# Altium schematic sheet 06-USB3_PCIe.SchDoc: USB3.0 Interface & EEPROM, PCIe
size A3; DrawnBy: Rain Adelbert; Revision: 1.2; SheetNumber: 6; SheetTotal: 9
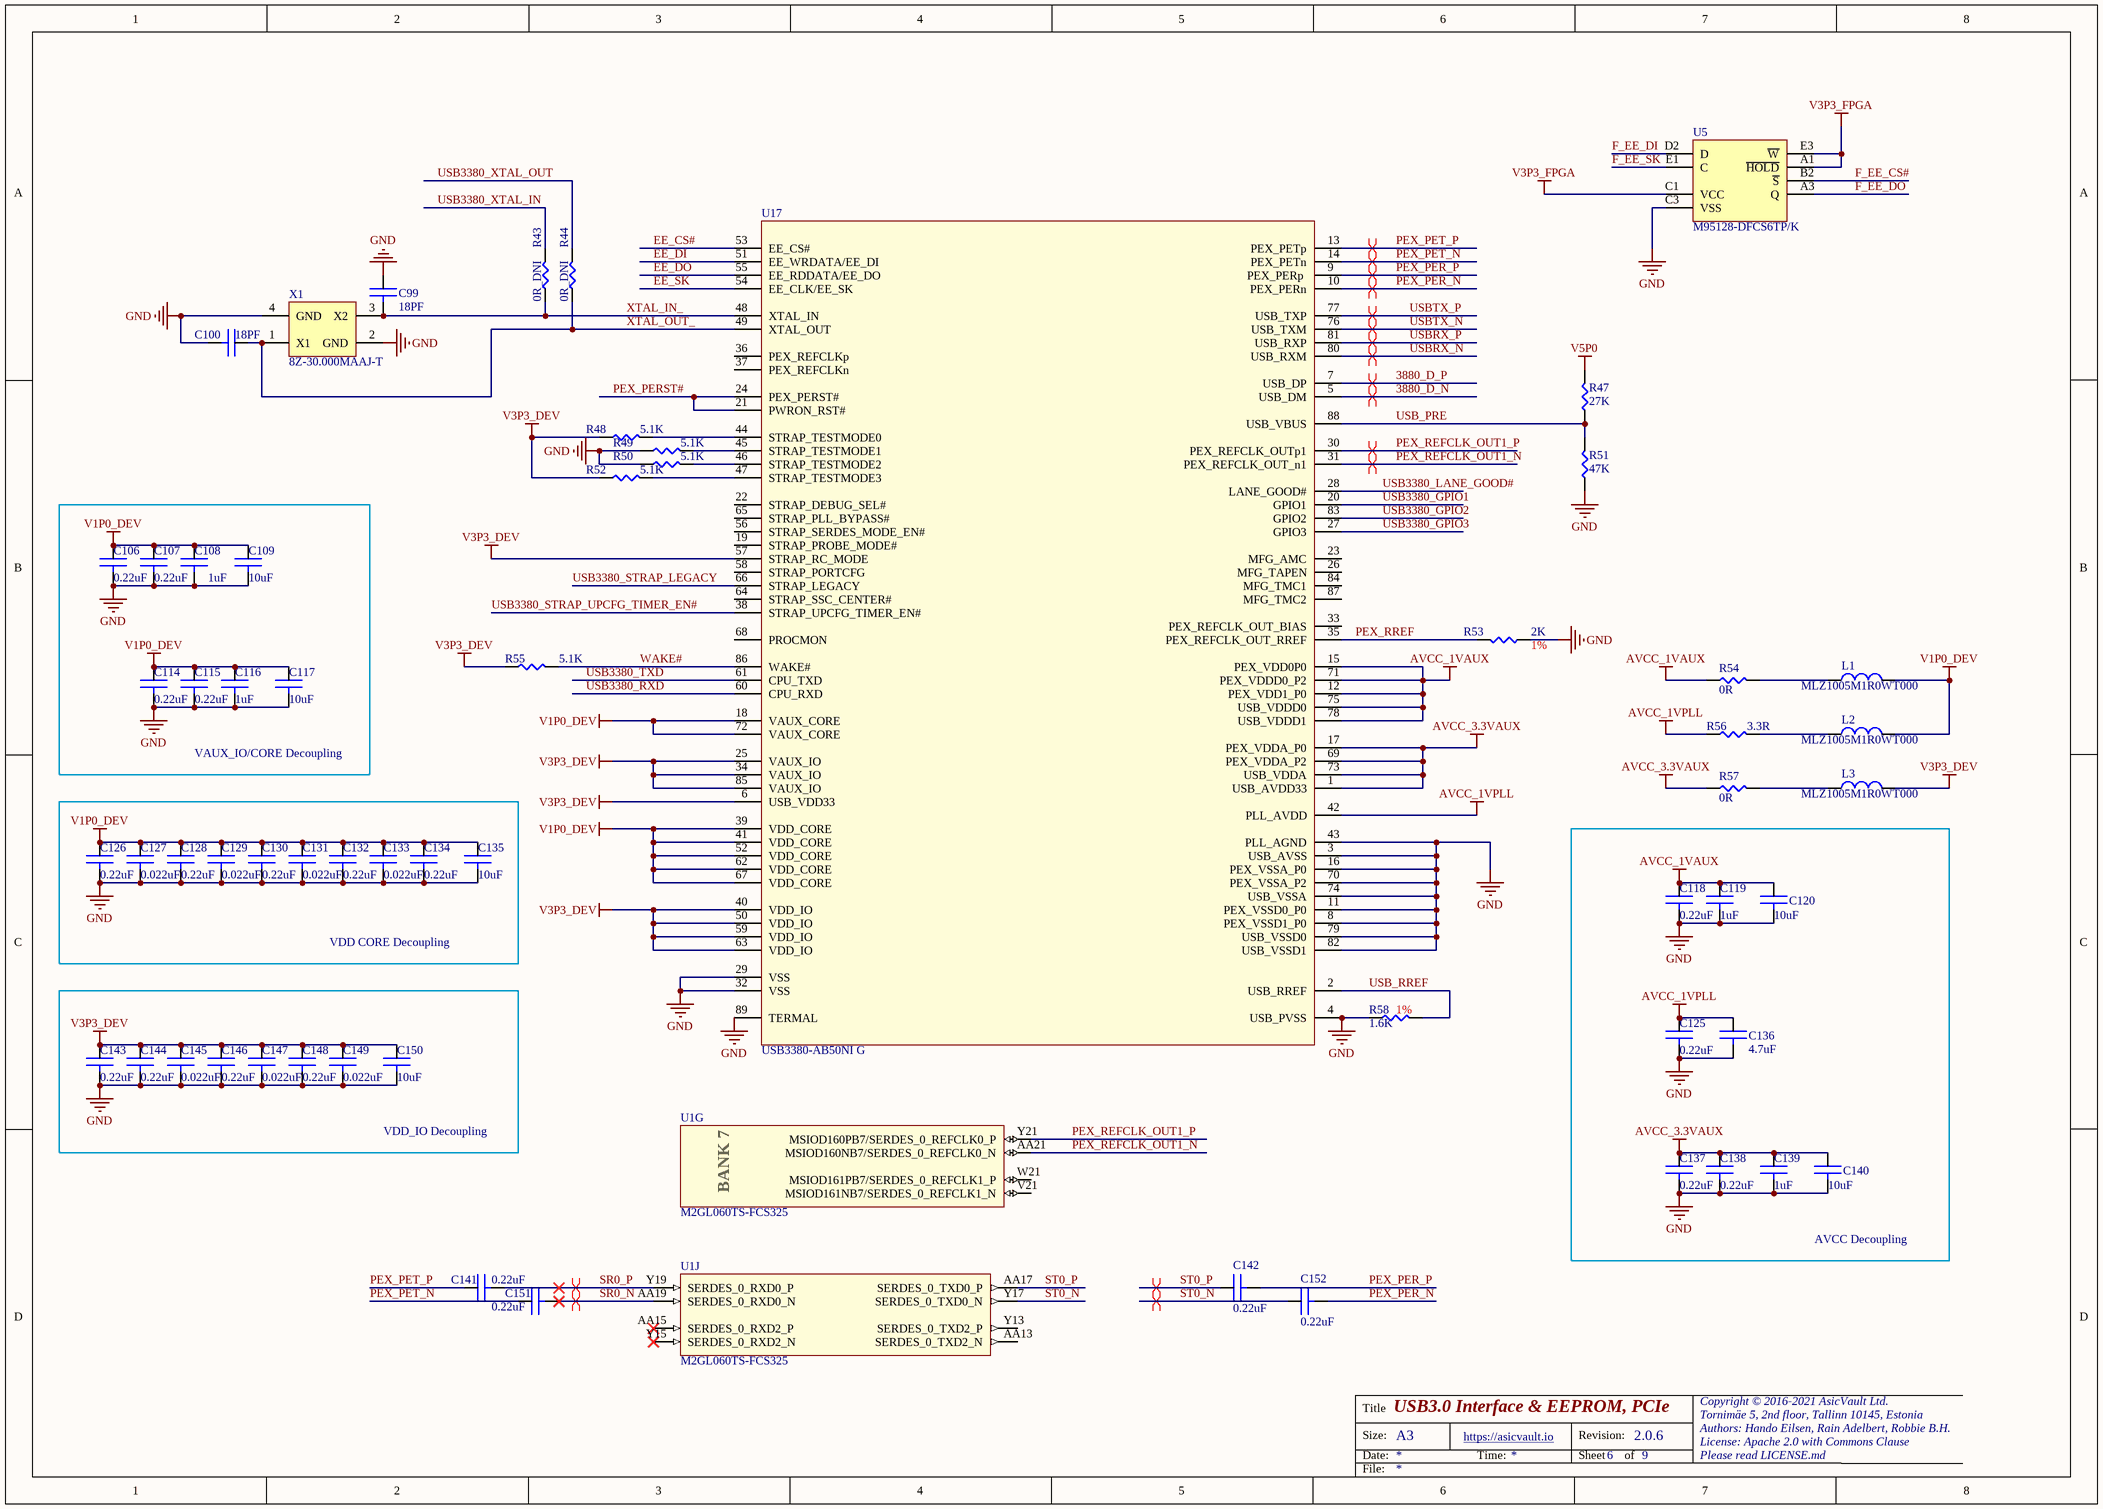
[diagram p0: 06-USB3_PCIe.SchDoc]

## Parts
C99  18PF  [C0201]
C100  18PF  [C0201]
C106  0.22uF  [C0201]
C107  0.22uF  [C0201]
C108  1uF  [C0201]
C109  10uF  [C0402]
C114  0.22uF  [C0201]
C115  0.22uF  [C0201]
C116  1uF  [C0201]
C117  10uF  [C0402]
C118  0.22uF  [C0201]
C119  1uF  [C0201]
C120  10uF  [C0402]
C125  0.22uF  [C0201]
C126  0.22uF  [C0201]
C127  0.022uF  [C0201]
C128  0.22uF  [C0201]
C129  0.022uF  [C0201]
C130  0.22uF  [C0201]
C131  0.022uF  [C0201]
C132  0.22uF  [C0201]
C133  0.022uF  [C0201]
C134  0.22uF  [C0201]
C135  10uF  [C0402]
C136  4.7uF  [C0201]
C137  0.22uF  [C0201]
C138  0.22uF  [C0201]
C139  1uF  [C0201]
C140  10uF  [C0402]
C141  0.22uF  [C0201]
C142  0.22uF  [C0201]
C143  0.22uF  [C0201]
C144  0.22uF  [C0201]
C145  0.022uF  [C0201]
C146  0.22uF  [C0201]
C147  0.022uF  [C0201]
C148  0.22uF  [C0201]
C149  0.022uF  [C0201]
C150  10uF  [C0402]
C151  0.22uF  [C0201]
C152  0.22uF  [C0201]
L1  MLZ1005M1R0WT000  [L0402]
L2  MLZ1005M1R0WT000  [L0402]
L3  MLZ1005M1R0WT000  [L0402]
R43  0R_DNI  [R0201]
R44  0R_DNI  [R0201]
R47  27K  [R0201]
R48  5.1K  [R0201]
R49  5.1K  [R0201]
R50  5.1K  [R0201]
R51  47K  [R0201]
R52  5.1K  [R0201]
R53  2K  [R0201]
R54  0R  [R0201]
R55  5.1K  [R0201]
R56  3.3R  [R0201]
R57  0R  [R0201]
R58  1.6K  [R0201]
U1  M2GL060TS-FCS325  [FCS325-OPT1]  (parts G,J of 16)
U5  M95128-DFCS6TP/K  [WLCSP8]
U17  USB3380-AB50NI G  [QFN88P]
X1  8Z-30.000MAAJ-T  [2520]

## Blocks framed on the sheet
VAUX_IO/CORE Decoupling: C106-C109 C114-C117
VDD CORE Decoupling: C126-C135
AVCC Decoupling: C118-C120 C125 C136-C140
VDD_IO Decoupling: C143-C150

## Nets
AVCC_1VAUX: C118.1 C119.1 C120.1 R54.1 U17.12(PEX_VDD1_P0) U17.15(PEX_VDD0P0) U17.71(PEX_VDDD0_P2) U17.75(USB_VDDD0) U17.78(USB_VDDD1)
AVCC_1VPLL: C125.1 C136.1 R56.1 U17.42(PLL_AVDD)
AVCC_3.3VAUX: C137.1 C138.1 C139.1 C140.1 R57.1 U17.1(USB_AVDD33) U17.17(PEX_VDDA_P0) U17.69(PEX_VDDA_P2) U17.73(USB_VDDA)
GND: C99.1 C100.2 C106.2 C107.2 C108.2 C109.2 C114.2 C115.2 C116.2 C117.2 C118.2 C119.2 C120.2 C125.2 C126.2 C127.2 C128.2 C129.2 C130.2 C131.2 C132.2 C133.2 C134.2 C135.2 C136.2 C137.2 C138.2 C139.2 C140.2 C143.2 C144.2 C145.2 C146.2 C147.2 C148.2 C149.2 C150.2 R49.1 R50.1 R51.1 R53.1 R58.1 U5.C3(VSS) U17.3(USB_AVSS) U17.4(USB_PVSS) U17.8(PEX_VSSD1_P0) U17.11(PEX_VSSD0_P0) U17.16(PEX_VSSA_P0) U17.29(VSS) U17.32(VSS) U17.43(PLL_AGND) U17.70(PEX_VSSA_P2) U17.74(USB_VSSA) U17.79(USB_VSSD0) U17.82(USB_VSSD1) U17.89(TERMAL) X1.2(GND) X1.4(GND)
V1P0_DEV: C106.1 C107.1 C108.1 C109.1 C114.1 C115.1 C116.1 C117.1 C126.1 C127.1 C128.1 C129.1 C130.1 C131.1 C132.1 C133.1 C134.1 C135.1 L1.2 L2.2 U17.18(VAUX_CORE) U17.39(VDD_CORE) U17.41(VDD_CORE) U17.52(VDD_CORE) U17.62(VDD_CORE) U17.67(VDD_CORE) U17.72(VAUX_CORE)
V3P3_DEV: C143.1 C144.1 C145.1 C146.1 C147.1 C148.1 C149.1 C150.1 L3.2 R48.1 R52.1 R55.1 U17.6(USB_VDD33) U17.25(VAUX_IO) U17.34(VAUX_IO) U17.40(VDD_IO) U17.50(VDD_IO) U17.57(STRAP_RC_MODE) U17.59(VDD_IO) U17.63(VDD_IO) U17.85(VAUX_IO)
V3P3_FPGA: U5.A1(~{HOLD}) U5.C1(VCC) U5.E3(~{W})
V5P0: R47.2
3880_D_N: U17.5(USB_DM)
3880_D_P: U17.7(USB_DP)
EE_CS#: U17.53(EE_CS#)
EE_DI: U17.51(EE_WRDATA/EE_DI)
EE_DO: U17.55(EE_RDDATA/EE_DO)
EE_SK: U17.54(EE_CLK/EE_SK)
F_EE_CS#: U5.B2(~{S})
F_EE_DI: U5.D2(D)
F_EE_DO: U5.A3(Q)
F_EE_SK: U5.E1(C)
PEX_PER_N: C152.2 U17.10(PEX_PERn)
PEX_PER_P: C142.2 U17.9(PEX_PERp)
PEX_PERST#: U17.21(PWRON_RST#) U17.24(PEX_PERST#)
PEX_PET_N: C151.1 U17.14(PEX_PETn)
PEX_PET_P: C141.1 U17.13(PEX_PETp)
PEX_REFCLK_OUT1_N: U1.AA21(MSIOD160NB7/SERDES_0_REFCLK0_N) U17.31(PEX_REFCLK_OUT_n1)
PEX_REFCLK_OUT1_P: U1.Y21(MSIOD160PB7/SERDES_0_REFCLK0_P) U17.30(PEX_REFCLK_OUTp1)
PEX_RREF: R53.2 U17.35(PEX_REFCLK_OUT_RREF)
SR0_N: C151.2 U1.AA19(SERDES_0_RXD0_N)
SR0_P: C141.2 U1.Y19(SERDES_0_RXD0_P)
ST0_N: C152.1 U1.Y17(SERDES_0_TXD0_N)
ST0_P: C142.1 U1.AA17(SERDES_0_TXD0_P)
USB3380_GPIO1: U17.20(GPIO1)
USB3380_GPIO2: U17.83(GPIO2)
USB3380_GPIO3: U17.27(GPIO3)
USB3380_LANE_GOOD#: U17.28(LANE_GOOD#)
USB3380_RXD: U17.60(CPU_RXD)
USB3380_STRAP_LEGACY: U17.66(STRAP_LEGACY)
USB3380_STRAP_UPCFG_TIMER_EN#: U17.38(STRAP_UPCFG_TIMER_EN#)
USB3380_TXD: U17.61(CPU_TXD)
USB3380_XTAL_IN: R43.2
USB3380_XTAL_OUT: R44.2
USB_PRE: R47.1 R51.2 U17.88(USB_VBUS)
USB_RREF: R58.2 U17.2(USB_RREF)
USBRX_N: U17.80(USB_RXM)
USBRX_P: U17.81(USB_RXP)
USBTX_N: U17.76(USB_TXM)
USBTX_P: U17.77(USB_TXP)
WAKE#: R55.2 U17.86(WAKE#)
XTAL_IN_: C99.2 R43.1 U17.48(XTAL_IN) X1.3(X2)
XTAL_OUT_: C100.1 R44.1 U17.49(XTAL_OUT) X1.1(X1)
NetL1_1: L1.1 R54.2
NetL2_1: L2.1 R56.2
NetL3_1: L3.1 R57.2
NetR48_2: R48.2 U17.44(STRAP_TESTMODE0)
NetR49_2: R49.2 U17.45(STRAP_TESTMODE1)
NetR50_2: R50.2 U17.46(STRAP_TESTMODE2)
NetR52_2: R52.2 U17.47(STRAP_TESTMODE3)

Not connected (* = marked no-connect by the designer): U1 AA13(SERDES_0_TXD2_N) AA15(SERDES_0_RXD2_P)* V21(MSIOD161NB7/SERDES_0_REFCLK1_N) W21(MSIOD161PB7/SERDES_0_REFCLK1_P) Y13(SERDES_0_TXD2_P) Y15(SERDES_0_RXD2_N)*; U17 19(STRAP_PROBE_MODE#) 22(STRAP_DEBUG_SEL#) 23(MFG_AMC) 26(MFG_TAPEN) 33(PEX_REFCLK_OUT_BIAS) 36(PEX_REFCLKp) 37(PEX_REFCLKn) 56(STRAP_SERDES_MODE_EN#) 58(STRAP_PORTCFG) 64(STRAP_SSC_CENTER#) 65(STRAP_PLL_BYPASS#) 68(PROCMON) 84(MFG_TMC1) 87(MFG_TMC2)

## Layout directives
differential pair: 3880_D_N, 3880_D_P, PEX_PER_N, PEX_PER_P, PEX_PET_N, PEX_PET_P, PEX_REFCLK_OUT1_N, PEX_REFCLK_OUT1_P, SR0_N, SR0_P, ST0_N, ST0_P, USBRX_N, USBRX_P, USBTX_N, USBTX_P

## Notes on the sheet
- (near R53) 1%
- (near R58) 1%
- Title
- Size:
- Date:
- A3
- https://asicvault.io
- Time:
- Revision:
- Sheet
- of
- 2.0.6
- Copyright © 2016-2021 AsicVault Ltd.
- Tornimäe 5, 2nd floor, Tallinn 10145, Estonia
- Authors: Hando Eilsen, Rain Adelbert, Robbie B.H.
- License: Apache 2.0 with Commons Clause
- Please read LICENSE.md
- File:
- (in symbol M2GL060TS-FCS325, part G) BANK 7

## Library data of the parts
C99 C100 = 18PF/0201: Description 1: CAP CER 18PF 25V NPO 0201; Supplier 1: Digi-Key; Supplier Part Number 1: 311-3314-1-ND
C106 C107 C114 C115 C118 C125 C126 C128 C130 C132 C134 C137 C138 C141-C144 C146 C148 C151 C152 = 0.22uF/0201: Description 1: CAP CER 0.22UF 6.3V X7S 0201; Supplier Part Number 1: 445-9075-1-ND; Supplier 1: Digi-Key
C108 C116 C119 C139 = 1uF/0201/CC0201KRX7R7BB103: Description 1: CAP CER 1UF 6.3V X5R 0201; Supplier 1: Digi-Key; Supplier Part Number 1: 311-1613-1-ND
C109 C117 C120 C135 C140 C150 = 10uF/0402: Description 1: Multilayer Ceramic Capacitors MLCC - SMD/SMT 10uF 20% 6.3 Volts 0402; Supplier Part Number 1: 791-0402X106M6R3CT; Supplier 1: Mouser
C127 C129 C131 C133 C145 C147 C149 = 0.022uF/0201: Description 1: CAP CER 0.022UF 10V X7S 0201; Supplier 1: Digi-Key; Supplier Part Number 1: 445-13740-1-ND
C136 = 4.7uF/0201: Description 1: CAP CER 4.7UF 4V X5R 0201; Supplier 1: Digi-Key; Supplier Part Number 1: 490-13229-6-ND
L1-L3 = 1uH/MLZ1005M1R0WT000: Description 1: FIXED IND 1UH 450MA 350 MOHM SMD; Supplier 1: Digi-Key; Supplier Part Number 1: 445-6379-1-ND
R43 R44 = 0R/0201: Description 1: RES SMD 0.0OHM JUMPER 1/20W 0201; Supplier 1: Digi-Key; Supplier Part Number 1: 311-0.0NCT-ND
R47 = 27K/1%/0201: Description 1: RES SMD 27K OHM 1% 1/20W 0201; Supplier 1: Digi-Key; Supplier Part Number 1: P27.0KABCT-ND
R48-R50 R52 R55 = 5.1K/1%/0201: Description 1: RES SMD 5.1K OHM 1% 1/20W 0201; Supplier 1: Digi-Key; Supplier Part Number 1: YAG2741CT-ND
R51 = 47K/1%/0201: Description 1: RES SMD 47K OHM 1% 1/20W 0201; Supplier 1: Digi-Key; Supplier Part Number 1: 311-47KMCT-ND
R53 = 2K/1%/0201: Description 1: RES SMD 2K OHM 1% 1/20W 0201; Supplier 1: Digi-Key; Supplier Part Number 1: YAG2280CT-ND
R54 R57 = 0R/0201: Description 1: RES SMD 0OHM JUMPER 1/20W 0201; Supplier 1: Mouser; Supplier Part Number 1: 603-RC0201FR-070RL
R56 = 3.3R/1%/0201: Description 1: RES SMD 3.3 OHM 1% 1/20W 0201; Supplier 1: Digi-Key; Supplier Part Number 1: AC0201FR-073R3L-ND
R58 = 1.6K/1%/0201: Description 1: RES SMD 1.6K OHM 1% 1/20W 0201; Supplier 1: Digi-Key; Supplier Part Number 1: YAG2488CT-ND
U1 = M2GL060TS-FCS325: Description 1: IC FPGA 200 I/O 325FCBGA; Supplier 1: Digi-Key; Supplier Part Number 1: M2GL060TS-FCS325-ND
U5 = M95128-DFCS6TP/K: Description 1: IC EEPROM 128KBIT 2MHZ WLCSP; Supplier 1: Digi-Key; Supplier Part Number 1: 497-15028-1-ND
U17 = USB3380-AB50NI G: Description 1: IC CONTROLLER PCI USB 2.0 88QFN; Supplier 1: Digi-Key; Supplier Part Number 1: 516-3418-ND
X1 = 8Z-30.000MAAJ-T: Description 1: CRYSTAL 30.0000MHZ 18PF SMD; Supplier 1: Digi-Key; Supplier Part Number 1: 887-1490-1-ND